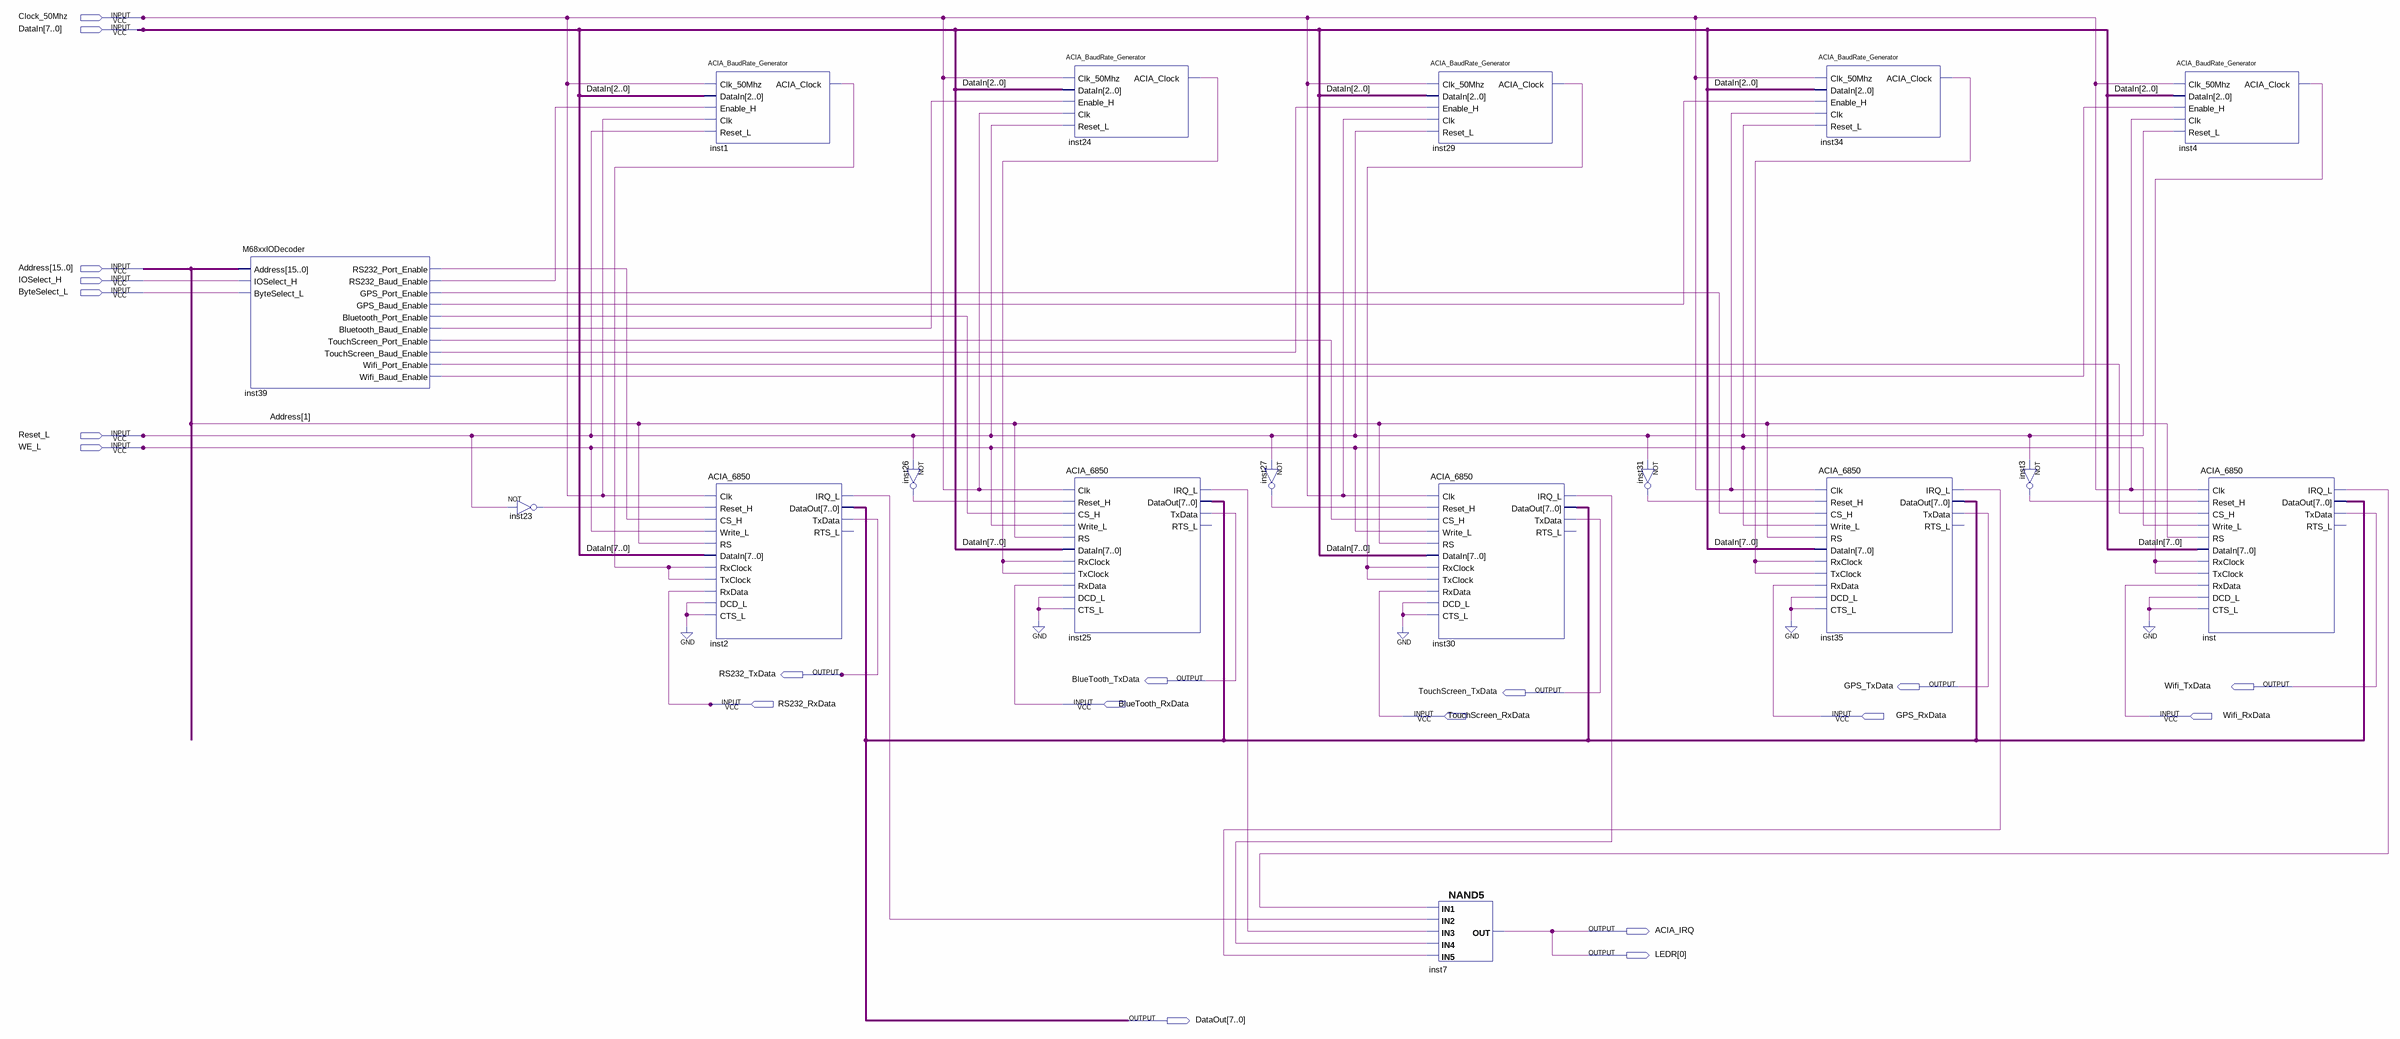
[diagram p0: schematic sheet]
// Quartus schematic OnChipM68xxIO.bdf as structural Verilog: 17 symbols, 20 pins
module OnChipM68xxIO (
  input  Clock_50Mhz,
  input  [7:0] DataIn,
  input  [15:0] Address,
  input  IOSelect_H,
  input  ByteSelect_L,
  input  Reset_L,
  input  WE_L,
  input  RS232_RxData,
  input  BlueTooth_RxData,
  input  TouchScreen_RxData,
  input  GPS_RxData,
  input  Wifi_RxData,
  output RS232_TxData,
  output BlueTooth_TxData,
  output GPS_TxData,
  output Wifi_TxData,
  output TouchScreen_TxData,
  output ACIA_IRQ,
  output [0:0] LEDR,
  output [7:0] DataOut
);

  wire inst1_acia_clock, inst2_irq_l, inst3_out, inst4_acia_clock, inst23_out, inst24_acia_clock,
       inst25_irq_l, inst26_out, inst27_out, inst29_acia_clock, inst30_irq_l, inst31_out, inst34_acia_clock,
       inst35_irq_l, inst39_bluetooth_baud_enable, inst39_bluetooth_port_enable, inst39_gps_baud_enable,
       inst39_gps_port_enable, inst39_rs232_baud_enable, inst39_rs232_port_enable,
       inst39_touchscreen_baud_enable, inst39_touchscreen_port_enable, inst39_wifi_baud_enable,
       inst39_wifi_port_enable, inst_irq_l;

  M68xxIODecoder inst39 (
    .Address(Address), .IOSelect_H(IOSelect_H), .ByteSelect_L(ByteSelect_L),
    .RS232_Port_Enable(inst39_rs232_port_enable), .RS232_Baud_Enable(inst39_rs232_baud_enable),
    .GPS_Port_Enable(inst39_gps_port_enable), .GPS_Baud_Enable(inst39_gps_baud_enable),
    .Bluetooth_Port_Enable(inst39_bluetooth_port_enable),
    .Bluetooth_Baud_Enable(inst39_bluetooth_baud_enable),
    .TouchScreen_Port_Enable(inst39_touchscreen_port_enable),
    .TouchScreen_Baud_Enable(inst39_touchscreen_baud_enable), .Wifi_Port_Enable(inst39_wifi_port_enable),
    .Wifi_Baud_Enable(inst39_wifi_baud_enable));
  not inst23 (inst23_out, Reset_L);
  ACIA_BaudRate_Generator inst1 (
    .Clk_50Mhz(Clock_50Mhz), .DataIn(DataIn[2:0]), .Enable_H(inst39_rs232_baud_enable), .Clk(Clock_50Mhz),
    .Reset_L(Reset_L), .ACIA_Clock(inst1_acia_clock));
  ACIA_6850 inst2 (
    .Clk(Clock_50Mhz), .Reset_H(inst23_out), .CS_H(inst39_rs232_port_enable), .Write_L(WE_L),
    .RS(Address[1]), .DataIn(DataIn), .RxClock(inst1_acia_clock), .TxClock(inst1_acia_clock),
    .RxData(RS232_RxData), .DCD_L(1'b0), .CTS_L(1'b0), .IRQ_L(inst2_irq_l), .DataOut(DataOut),
    .TxData(RS232_TxData));  // open: RTS_L
  not inst26 (inst26_out, Reset_L);
  ACIA_BaudRate_Generator inst24 (
    .Clk_50Mhz(Clock_50Mhz), .DataIn(DataIn[2:0]), .Enable_H(inst39_bluetooth_baud_enable),
    .Clk(Clock_50Mhz), .Reset_L(Reset_L), .ACIA_Clock(inst24_acia_clock));
  ACIA_6850 inst25 (
    .Clk(Clock_50Mhz), .Reset_H(inst26_out), .CS_H(inst39_bluetooth_port_enable), .Write_L(WE_L),
    .RS(Address[1]), .DataIn(DataIn), .RxClock(inst24_acia_clock), .TxClock(inst24_acia_clock),
    .RxData(BlueTooth_RxData), .DCD_L(1'b0), .CTS_L(1'b0), .IRQ_L(inst25_irq_l), .DataOut(DataOut),
    .TxData(BlueTooth_TxData));  // open: RTS_L
  not inst27 (inst27_out, Reset_L);
  ACIA_BaudRate_Generator inst29 (
    .Clk_50Mhz(Clock_50Mhz), .DataIn(DataIn[2:0]), .Enable_H(inst39_touchscreen_baud_enable),
    .Clk(Clock_50Mhz), .Reset_L(Reset_L), .ACIA_Clock(inst29_acia_clock));
  ACIA_6850 inst30 (
    .Clk(Clock_50Mhz), .Reset_H(inst27_out), .CS_H(inst39_touchscreen_port_enable), .Write_L(WE_L),
    .RS(Address[1]), .DataIn(DataIn), .RxClock(inst29_acia_clock), .TxClock(inst29_acia_clock),
    .RxData(TouchScreen_RxData), .DCD_L(1'b0), .CTS_L(1'b0), .IRQ_L(inst30_irq_l), .DataOut(DataOut),
    .TxData(TouchScreen_TxData));  // open: RTS_L
  nand inst7 (ACIA_IRQ, inst_irq_l, inst2_irq_l, inst25_irq_l, inst30_irq_l, inst35_irq_l);
  not inst31 (inst31_out, Reset_L);
  ACIA_BaudRate_Generator inst34 (
    .Clk_50Mhz(Clock_50Mhz), .DataIn(DataIn[2:0]), .Enable_H(inst39_gps_baud_enable), .Clk(Clock_50Mhz),
    .Reset_L(Reset_L), .ACIA_Clock(inst34_acia_clock));
  ACIA_6850 inst35 (
    .Clk(Clock_50Mhz), .Reset_H(inst31_out), .CS_H(inst39_gps_port_enable), .Write_L(WE_L), .RS(Address[1]),
    .DataIn(DataIn), .RxClock(inst34_acia_clock), .TxClock(inst34_acia_clock), .RxData(GPS_RxData),
    .DCD_L(1'b0), .CTS_L(1'b0), .IRQ_L(inst35_irq_l), .DataOut(DataOut), .TxData(GPS_TxData));  // open: RTS_L
  not inst3 (inst3_out, Reset_L);
  ACIA_BaudRate_Generator inst4 (
    .Clk_50Mhz(Clock_50Mhz), .DataIn(DataIn[2:0]), .Enable_H(inst39_wifi_baud_enable), .Clk(Clock_50Mhz),
    .Reset_L(Reset_L), .ACIA_Clock(inst4_acia_clock));
  ACIA_6850 inst (
    .Clk(Clock_50Mhz), .Reset_H(inst3_out), .CS_H(inst39_wifi_port_enable), .Write_L(WE_L), .RS(Address[1]),
    .DataIn(DataIn), .RxClock(inst4_acia_clock), .TxClock(inst4_acia_clock), .RxData(Wifi_RxData),
    .DCD_L(1'b0), .CTS_L(1'b0), .IRQ_L(inst_irq_l), .DataOut(DataOut), .TxData(Wifi_TxData));  // open: RTS_L

  assign LEDR[0] = ACIA_IRQ;
endmodule
